# EAGLE design linkit_smart_extendboard (EAGLE 7.6.0)
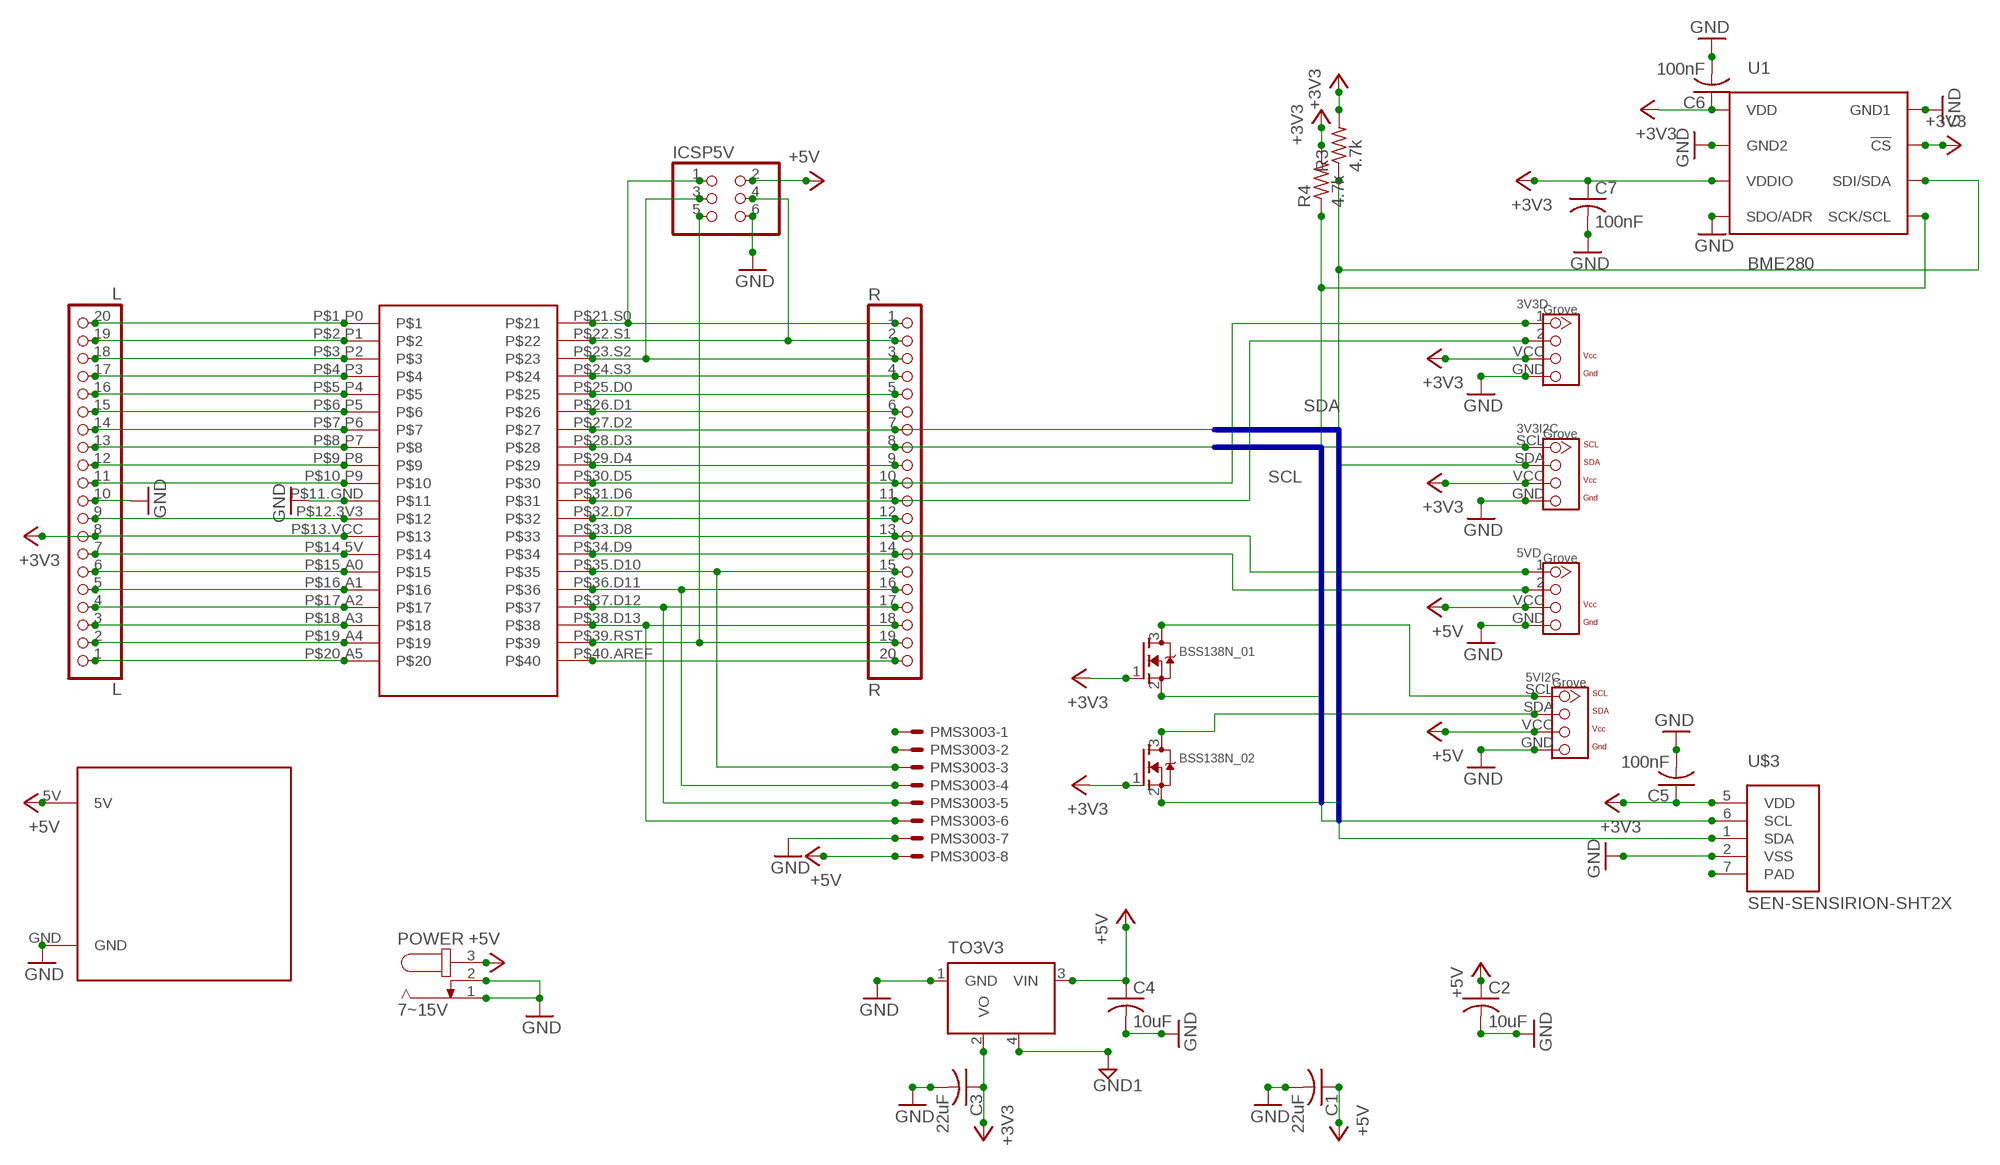
[diagram p0: schematic, sheet 1]

## Parts
3V3D  TWIG-4P-2.0-2.0  [4P-2.0]
3V3I2C  TWIG-4P-2.0-2.0  [4P-2.0]
5VD  TWIG-4P-2.0-2.0  [4P-2.0]
5VI2C  TWIG-4P-2.0-2.0  [4P-2.0]
BSS138N_01  MOSFET-NWAVE  [SOT23-W]
BSS138N_02  MOSFET-NWAVE  [SOT23-W]
C1  22uF  C-USC0805K  [C0805K]
C2  10uF  C-USC0805K  [C0805K]
C3  22uF  C-USC0805K  [C0805K]
C4  10uF  C-USC0805K  [C0805K]
C5  100nF  C-USC0805K  [C0805K]
C6  100nF  C-USC0805K  [C0805K]
C7  100nF  C-USC0805K  [C0805K]
ICSP5V  PINHD-2X3  [2X03]
L  L  PINHD-1X20-BIG  [1X20-BIG]
PMS3003  53047-08  [53047-08]
POWER  7~15V  JACK-PLUG0  [SPC4077]
R  R  PINHD-1X20-BIG  [1X20-BIG]
R3  4.7k  R-US_R0805  [R0805]
R4  4.7k  R-US_R0805  [R0805]
TO3V3  LM2936MP-3.0  [SOT223]
U1  BME280  [BME280_LGA]
U$1  LINKIT7688  [LINKIT7688]
U$3  SEN-SENSIRION-SHT2X  [SEN-SENSIRION-SHT2X]
U$4  PIN2MM  [PIN2MM]

## Nets
+3V3: 3V3D.VCC 3V3I2C.VCC BSS138N_01.1(G) BSS138N_02.1(G) C3.1 C5.1 C6.1 C7.1 L.8 R3.2 R4.2 TO3V3.2(VO) U1.P$2(!CS) U1.P$6(VDDIO) U1.P$8(VDD) U$1.P$13.VCC U$3.5(VDD)
+5V: 5VD.VCC 5VI2C.VCC C1.1 C2.1 C4.1 ICSP5V.2 PMS3003.8 POWER.3 TO3V3.3(VIN) U$4.5V
GND: 3V3D.GND 3V3I2C.GND 5VD.GND 5VI2C.GND C1.2 C2.2 C3.2 C4.2 C5.2 C6.2 C7.2 ICSP5V.6 L.10 PMS3003.7 POWER.1 POWER.2 TO3V3.1(GND) U1.P$1(GND1) U1.P$5(SDO/ADR) U1.P$7(GND2) U$1.P$11.GND U$3.2(VSS) U$4.GND
GND1: TO3V3.4(HS)
N$1: L.9 U$1.P$12.3V3
N$2: PMS3003.3 R.15 U$1.P$35.D10
N$3: L.7 U$1.P$14.5V
N$4: L.6 U$1.P$15.A0
N$5: L.5 U$1.P$16.A1
N$6: L.4 U$1.P$17.A2
N$7: L.3 U$1.P$18.A3
N$8: L.2 U$1.P$19.A4
N$9: L.1 U$1.P$20.A5
N$10: 3V3D.1 R.10 U$1.P$30.D5
N$11: L.19 U$1.P$2.P1
N$12: L.18 U$1.P$3.P2
N$13: L.17 U$1.P$4.P3
N$14: L.16 U$1.P$5.P4
N$15: L.15 U$1.P$6.P5
N$16: L.14 U$1.P$7.P6
N$17: L.13 U$1.P$8.P7
N$18: L.12 U$1.P$9.P8
N$19: L.11 U$1.P$10.P9
N$20: L.20 U$1.P$1.P0
N$21: ICSP5V.1 R.1 U$1.P$21.S0
N$22: ICSP5V.4 R.2 U$1.P$22.S1
N$23: ICSP5V.3 R.3 U$1.P$23.S2
N$24: R.4 U$1.P$24.S3
N$25: R.5 U$1.P$25.D0
N$26: R.6 U$1.P$26.D1
N$27: R.9 U$1.P$29.D4
N$28: R.12 U$1.P$32.D7
N$29: PMS3003.4 R.16 U$1.P$36.D11
N$30: 5VD.2 R.14 U$1.P$34.D9
N$31: 3V3D.2 R.11 U$1.P$31.D6
N$32: U$3.7(PAD)
N$33: 5VD.1 R.13 U$1.P$33.D8
N$34: ICSP5V.5 R.19 U$1.P$39.RST
N$35: PMS3003.6 R.18 U$1.P$38.D13
N$36: 5VI2C.SCL BSS138N_01.3(D)
N$37: R.20 U$1.P$40.AREF
N$38: PMS3003.5 R.17 U$1.P$37.D12
N$39: 5VI2C.SDA BSS138N_02.3(D)
N$40: PMS3003.1
N$41: PMS3003.2
SCL: 3V3I2C.SCL BSS138N_01.2(S) R4.1 R.8 U1.P$4(SCK/SCL) U$1.P$28.D3 U$3.6(SCL)
SDA: 3V3I2C.SDA BSS138N_02.2(S) R3.1 R.7 U1.P$3(SDI/SDA) U$1.P$27.D2 U$3.1(SDA)

## Buses
SDA
SCL

## Library data of the parts
3V3D 5VD = Connector_grove:TWIG-4P-2.0
3V3I2C 5VI2C = Connector_grove_i2c:TWIG-4P-2.0
BSS138N_01 BSS138N_02 = adafruit:MOSFET-N: N-Channel Mosfet 2N7002E - 60V 260mA SOT23 [Digikey: 2N7002ET1GOSTR-ND] - REEL BSH103 - 30V 850mA SOT23 [Digikey: 568-5013-1-ND]
C1-C7 = rcl:C-US: CAPACITOR, American symbol
ICSP5V = pinhead:PINHD-2X3: PIN HEADER
L R = adafruit:PINHD-1X20: PIN HEADER
PMS3003 = con-molex:53?-08: CONNECTOR wire to board 1.25 mm (.049 inch) pitch header; MPN: 53047-0810; OC_FARNELL: 1012258; OC_NEWARK: 98K9826
POWER = con-jack:JACK-PLUG: DC POWER JACK Power Jack, DC, Right Angle, Through Hole, Rated 5A at 16VDC, PC Terminals Distributor: Farnell (www.Farnell.de) Drawing: 84N1161.pdf / 84N1162.pdf Manufacturer: SPC Technology (www.spctechnology.com) Type: SPC4077 / SPC 4078; OC_FARNELL: unknown; OC_NEWARK: unknown
R3 R4 = resistor:R-US_: RESISTOR, American symbol
TO3V3 = national-semiconductor:LM2936MP?*: Ultra-Low Quiescent Current LDO Voltage Regulator Source: Data sheet <http://www.national.com/ds/LM/LM2936.pdf>; MF: NATIONAL SEMICONDUCTOR; MPN: LM2936MP-3.0/NOPB; OC_FARNELL: 1496125; OC_NEWARK: 41K4522
U1 = BME280ComponentLibrary:BME280; PROD_ID: IC-13090
U$1 = linkit7688:LINKIT7688: Linkit Smart 7688
U$3 = sht2x:SEN-SENSIRION-SHT2X
U$4 = pin_2mm:PIN2MM: 2mm pin head

## Module PIN
Ports: 

### Library data of the parts

## Board
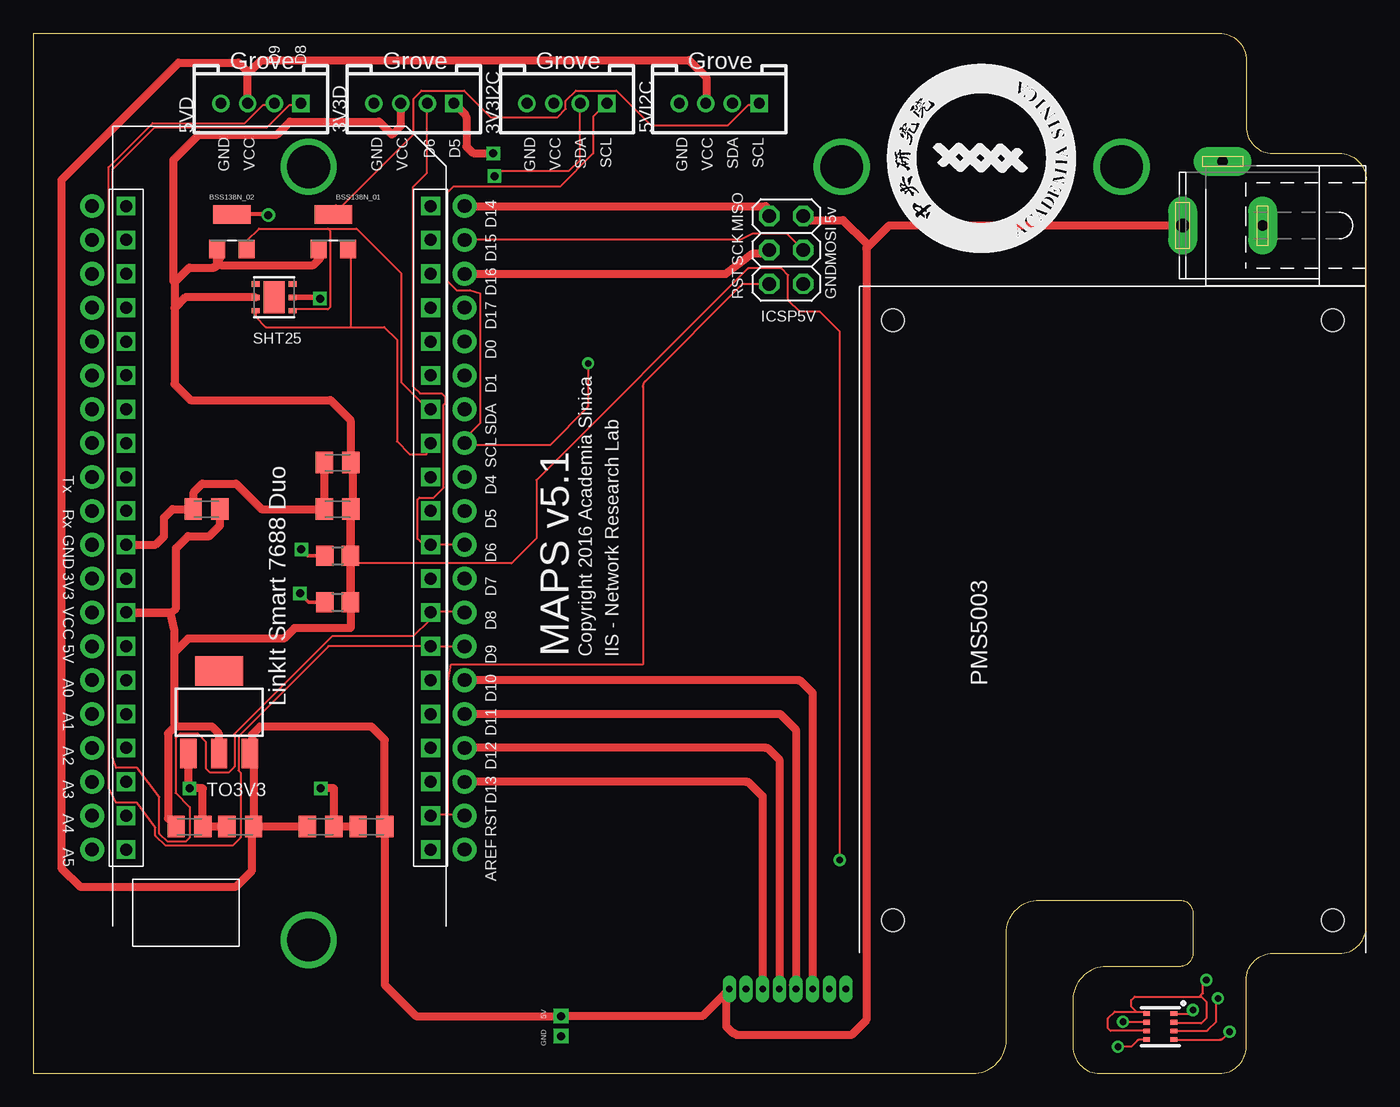
[diagram p1: board, top side]
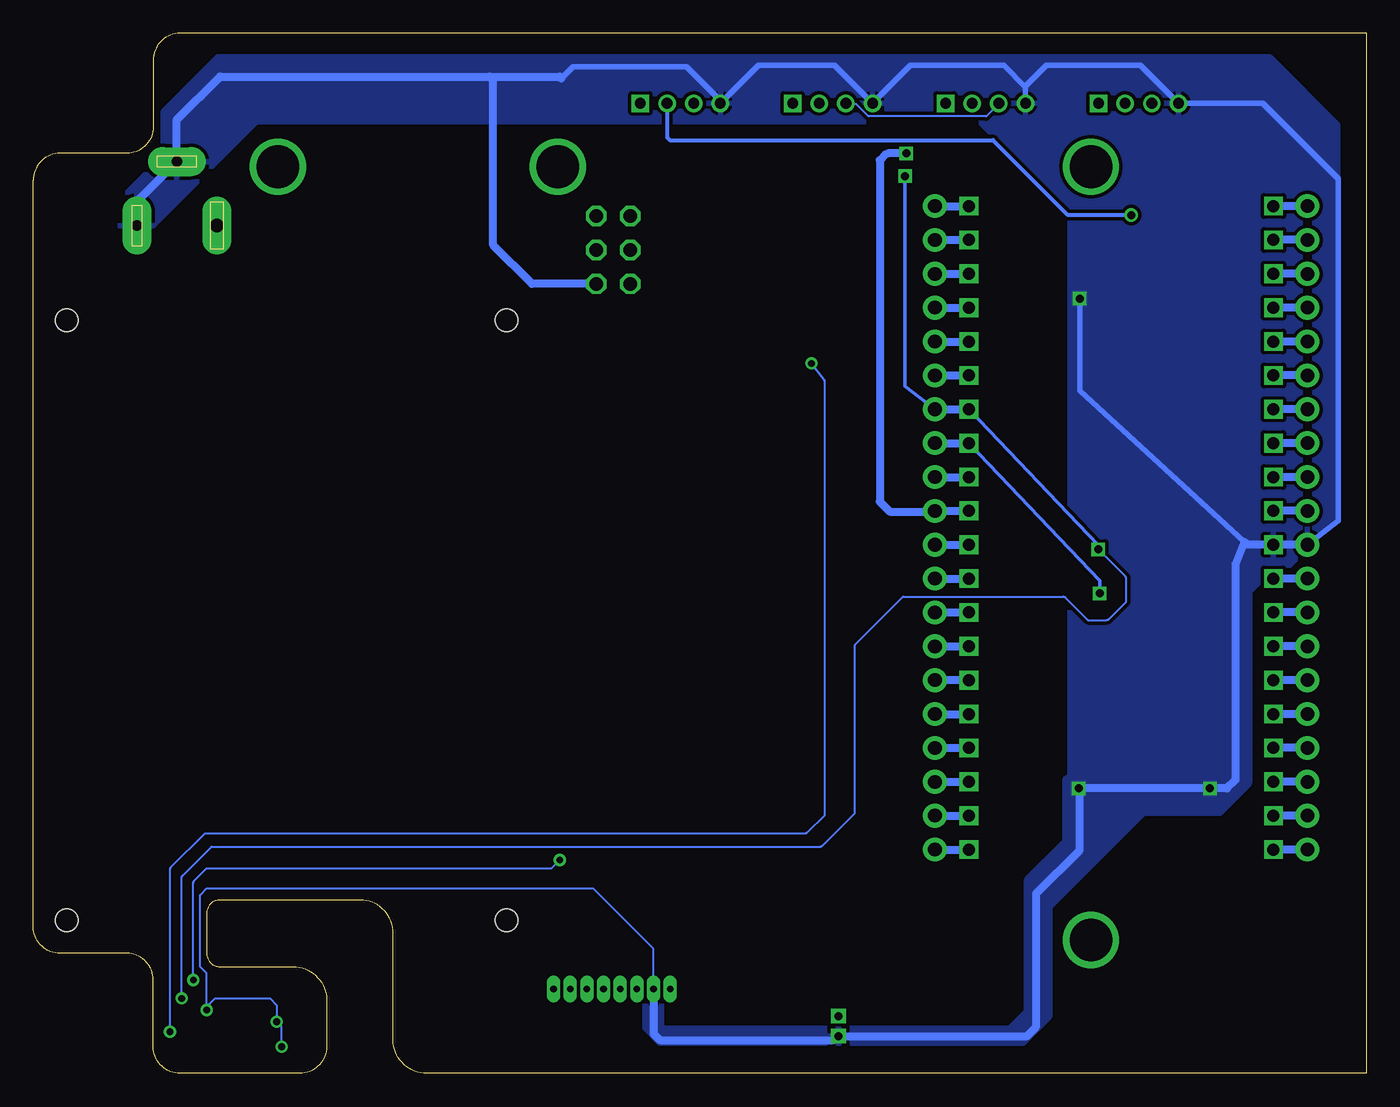
[diagram p2: board, bottom side, seen from below]

Size 100 x 78 mm. Coordinates in mm from the lower left corner, seen from the top.
Outline: 100,11 100,67 arc90 98,69 93,69 arc-90 91,71 91,76 arc90 89,78 0,78 0,0 70.5,0 arc90 73,2.5 73,10.5 arc-90 75.5,13 86,13 arc-90 87,12 87,9 arc-90 86,8 80.5,8 arc90 78,5.5 78,2 arc90 80,0 89,0 arc90 91,2 91,7 arc-90 93,9 98,9 arc90 100,11
Copper layers (1*16): Top 0.035mm / dielectric 1.5mm / Bottom 0.035mm
Design rules "jetpcb *": minimum track width 5mil, minimum drill 0.2499375mm, track to track 5mil, track to pad 5mil, pad to pad 5mil, via to via 5mil, smd to smd 5mil, copper to edge 0mil, drill to drill 0.2499375mm, minimum pad ring 10mil, minimum via ring 8mil, stop-mask expansion 4mil, vias tented up to drill 0mil, thermal gap 10mil
Holes 1.7 mm at 97.5,56.5 64.5,56.5 97.5,11.5 64.5,11.5

### Footprints (pad centres in the part's own frame; a part is rotated, then mirrored left to right if it is on the bottom)
4P-2.0 = drill 0.8 pad 1.27 square: 1 -3,0 | drill 0.8 pad 1.27: 2 -1,0; GND 3,0; VCC 1,0
4P-2.0' = drill 0.8 pad 1.27: GND 3,0; SDA -1,0; VCC 1,0 | drill 0.8 pad 1.27 square: SCL -3,0
SOT23-W = smd 1.2 x 1.4: 1 -1.1,-1.3; 2 1.1,-1.3 | smd 2.8 x 1.4: 3 0,1.3
C0805K = smd 1.3 x 1.6: 1 -1,0; 2 1,0
2X03 = drill 1.016 octagon: 1 -2.54,-1.27; 2 -2.54,1.27; 3 0,-1.27; 4 0,1.27; 5 2.54,-1.27; 6 2.54,1.27
1X20-BIG = drill 1.016 pad 1.778: 1 -24.13,0; 2 -21.59,0; 3 -19.05,0; 4 -16.51,0; 5 -13.97,0; 6 -11.43,0; 7 -8.89,0; 8 -6.35,0; 9 -3.81,0; 10 -1.27,0; 11 1.27,0; 12 3.81,0; 13 6.35,0; 14 8.89,0; 15 11.43,0; 16 13.97,0; 17 16.51,0; 18 19.05,0; 19 21.59,0; 20 24.13,0
53047-08 = drill 0.5 pad 0.698 long: 1 4.375,0.45; 2 3.125,0.45; 3 1.875,0.45; 4 0.625,0.45; 5 -0.625,0.45; 6 -1.875,0.45; 7 -3.125,0.45; 8 -4.375,0.45
SPC4077 = drill 0.8 pad 2.184 long: 1 -3,0; 2 0,-4.8 | drill 1 pad 2.184 long: 3 3,0
R0805 = smd 1.3 x 1.5: 1 -0.95,0; 2 0.95,0
SOT223 = smd 1.219 x 2.235: 1 -2.311,-3.099; 2 0,-3.099; 3 2.311,-3.099 | smd 3.6 x 2.2: 4 0,3.099
BME280_LGA = smd 0.5 x 0.35: P$1 1.025,0.975; P$2 1.025,0.325; P$3 1.025,-0.325; P$4 1.025,-0.975; P$5 -1.025,-0.975; P$6 -1.025,-0.325; P$7 -1.025,0.325; P$8 -1.025,0.975
LINKIT7688 = drill 0.9 square: P$1.P0 0,0; P$2.P1 0,-2.54; P$3.P2 0,-5.08; P$4.P3 0,-7.62; P$5.P4 0,-10.16; P$6.P5 0,-12.7; P$7.P6 0,-15.24; P$8.P7 0,-17.78; P$9.P8 0,-20.32; P$10.P9 0,-22.86; P$11.GND 0,-25.4; P$12.3V3 0,-27.94; P$13.VCC 0,-30.48; P$14.5V 0,-33.02; P$15.A0 0,-35.56; P$16.A1 0,-38.1; P$17.A2 0,-40.64; P$18.A3 0,-43.18; P$19.A4 0,-45.72; P$20.A5 0,-48.26; P$21.S0 22.86,0; P$22.S1 22.86,-2.54; P$23.S2 22.86,-5.08; P$24.S3 22.86,-7.62; P$25.D0 22.86,-10.16; P$26.D1 22.86,-12.7; P$27.D2 22.86,-15.24; P$28.D3 22.86,-17.78; P$29.D4 22.86,-20.32; P$30.D5 22.86,-22.86; P$31.D6 22.86,-25.4; P$32.D7 22.86,-27.94; P$33.D8 22.86,-30.48; P$34.D9 22.86,-33.02; P$35.D10 22.86,-35.56; P$36.D11 22.86,-38.1; P$37.D12 22.86,-40.64; P$38.D13 22.86,-43.18; P$39.RST 22.86,-45.72; P$40.AREF 22.86,-48.26
SEN-SENSIRION-SHT2X = smd 0.4 x 0.6: 1 -1,-1.4; 2 0,-1.4; 3 1,-1.4; 4 1,1.4; 5 0,1.4; 6 -1,1.4 | smd 2.4 x 1.6: 7 0,0
PIN2MM = drill 0.6 square: 5V 0.5,0.5; GND 2,0.5

### Placement (x,y rotation side)
3V3D  28.56,72.75 180 top
3V3I2C  [4P-2.0']  40.04,72.75 180 top
5VD  17.08,72.75 180 top
5VI2C  [4P-2.0']  51.45,72.75 180 top
BSS138N_01  22.51,63.12 0 top
BSS138N_02  14.89,63.12 0 top
C1  21.56,18.51 0 top
C2  25.37,18.51 180 top
C3  11.72,18.51 0 top
C4  15.53,18.51 180 top
C5  12.99,42.32 180 top
C6  22.83,45.81 180 top
C7  22.83,42.32 180 top
ICSP5V  56.48,61.75 270 top
L  4.42,40.91 90 top
PMS3003  56.59,5.87 0 top
POWER  89.23,63.58 180 top
R  32.35,40.91 270 top
R3  22.83,38.83 0 top
R4  22.83,35.34 0 top
TO3V3  13.94,27.08 0 top
U1  84.54,3.5 0 top
U$1  6.96,65.05 0 top
U$2  [G5]  99.98,9.03 180 top
U$3  18.07,58.2 90 top
U$4  39.1,4.8 270 top

### Tracks (layer width: path | path; a pad name or v marks a point on that pad's centre or on a via)
+3V3  (via drill 0.5)
  Top 0.152: 23.94,42.32 C7.1 | 23.94,45.81 C6.1 | 13.94,24.22 TO3V3.2 | 14,61.12 14,61.25 BSS138N_02.1 | U1.P$6 80.82,3.18 80.62,3.38 80.62,4.12 81.12,4.62 82.75,4.62 | 82.75,4.62 83.37,4.62 | 83.37,4.62 U1.P$8 83.38,4.62 83.37,4.62 | 87.5,5.75 87.62,5.75 88,5.38 88,4.12 87.62,3.75 85.64,3.75 U1.P$2 | 82.75,4.62 82.38,5 82.38,5.5 82.62,5.75 87.5,5.75 | 87.5,5.75 87.75,6 87.75,6.64 arc-45 87.82,6.82 v88,7 | v60.5,16 60.5,55.62 59,57.12 57.5,57.12 56.62,58 56.62,59.88 56.12,60.38 53.62,60.38 37.75,44.5 37.75,40.12 35.88,38.25 24.36,38.25 R3.2
  Top 0.61: 23.94,45.81 23.94,42.32 23.78,42.16 R3.2 R4.2 | 13.94,24.22 13.94,25.46 13.4,26 10.6,26 | 10.6,26 10.1,25.5 10.1,19.12 C3.1 | 10.6,26 10.6,31.6 | 10.6,31.6 10.6,33.2 10.3,34.5 7.52,34.5 U$1.P$13.VCC 10.37,34.56 10.7,34.9 10.7,39.4 11.6,40.3 13.2,40.3 14,41.1 14,42.31 C5.1 | C7.1 23.8,42.29 23.8,33.4 19.6,33.4 18.8,32.6 11.6,32.6 10.6,31.6 | 3V3D.VCC 27.56,71.06 26.9,70.4 25.93,71.38 19.25,71.38 18.27,70.4 12.4,70.4 10.5,68.5 10.5,59.42 10.6,59.33 | 10.6,59.33 10.6,57.4 | 10.6,57.4 10.6,51.7 11.8,50.5 22.3,50.5 23.8,49 23.8,45.84 C6.1 | 10.6,59.33 11.7,60.42 13.47,60.42 arc90 13.79,60.74 BSS138N_02.1 13.79,60.94 arc90 14.11,60.62 21,60.62 21.5,61.12 21.5,61.73 BSS138N_01.1 | U$3.5 11.39,58.2 10.6,57.4 | 13.8,61.12 14,61.12
  Bottom 0.152: 3V3I2C.VCC 39.01,72.69 38.25,72.69 37.34,71.78 28.5,71.78 27.58,72.69 3V3D.VCC | v60.5,16 61.12,15.38 68.38,15.38 68.88,15.38 87,15.38 87.93,14.45 arc-45 88,14.27 v88,7
  Bottom 0.61: L.8 U$1.P$13.VCC
+5V
  Top 0.61: C4.1 16.53,23.98 TO3V3.3 16.4,24.13 16.4,25.4 17,26 25.38,26 26.37,25 C2.1 26.38,6.62 28.7,4.3 U$4.5V 50.2,4.3 PMS3003.8 52.09,6.19 arc45 52,5.97 52,3.5 52.41,3.09 arc45 52.63,3 52.76,2.88 61.38,2.88 62.5,4 62.5,61.88 | C1.1 C4.1 | 5VI2C.VCC 50.5,72.8 50.5,74.7 49.2,76 17.1,76 16.08,74.98 5VD.VCC 16.08,75.12 15.4,75.8 10.9,75.8 2.1,67 2.1,15.4 3.5,14 15.2,14 16.4,15.2 16.4,18.38 C4.1 | ICSP5V.2 58.05,64 60.75,64 62.5,62.25 62.5,61.88 | POWER.3 64.2,63.58 62.5,61.88
GND  (via drill 0.5, 0.6)
  Top 0.152: v81.75,3.88 83.47,3.88 U1.P$7 | U1.P$1 86.73,4.48 v87,4.75 | U1.P$5 83.01,2.53 arc45 82.83,2.45 82.38,2 v81.38,2
  Top 0.406: U$3.2 21.41,58.2 v21.5,58.1
  Top 0.61: C2.2 C1.2 22.56,21.36 v21.56,21.36 | C4.2 C3.2 12.72,21.36 v11.72,21.36 11.63,21.36 TO3V3.1 | C6.2 C7.2 17.11,42.32 15.21,44.23 12.67,44.23 12.04,43.59 12.04,42.32 C5.2 10.45,42.32 9.81,41.69 9.81,40.28 9.18,39.65 U$1.P$11.GND
  Bottom 0.152: v81.38,2 81.38,3.5 v81.75,3.88 81.75,5.12 82.25,5.62 86.38,5.62 87,5 v87,4.75 87,7.5 87.5,8 87.5,13.38 87,13.88 58,13.88 53.5,9.38 53.5,6.35 PMS3003.7
  Bottom 0.406: L.10 2.1,41.46 2.1,67.1 7.75,72.75 5VD.GND 16.93,75.6 24,75.6 25.56,74.04 3V3D.GND 25.56,73.96 27.2,75.6 34.19,75.6 3V3I2C.GND 39.88,75.6 45.6,75.6 5VI2C.GND 48.45,72.95 51,75.5 59.5,75.5 60.38,74.62 | v21.5,58.1 21.5,51.2 9.15,39.85
  Bottom 0.61: U$1.P$11.GND L.10 8.86,39.65 9.15,39.85 9.81,38.19 9.81,22 10.45,21.36 v11.72,21.36 v21.56,21.36 21.5,21.3 21.5,16.75 24.75,13.5 24.75,3.5 25.45,2.8 U$4.GND 39.81,2.59 arc45 40.03,2.5 53,2.5 53.37,2.87 arc45 53.47,3.1 PMS3003.7 | POWER.1 92.23,65.38 POWER.2 89.23,71.52 86,74.75 65.75,74.75 | 65.75,74.75 60.5,74.75 60.38,74.62 | ICSP5V.6 62.59,59.21 65.5,62.12 65.5,74.5 65.75,74.75
  pour Bottom (isolate 0.254): 93.38,65.5 arc45 93.29,65.71 90.25,68.75 90.25,71.99 arc45 90.16,72.22 86.12,76.25 7.38,76.25 arc45 7.16,76.16 2.12,71.12 2.12,41.88 arc45 2.22,41.66 5.88,38 6.74,38 arc-45 6.97,37.91 8.75,36.12 8.75,21.88 arc45 8.84,21.66 11,19.5 16.62,19.5 arc-45 16.84,19.41 23.75,12.5 23.75,4.38 arc45 23.84,4.16 25.75,2.25 52.87,2.25 arc45 53.09,2.34 54.12,3.38 54.12,6.62 arc45 54.03,6.84 53.75,7.12 53.47,6.84 arc-45 53.24,6.75 53.12,6.75 52.97,6.59 arc45 52.88,6.37 52.88,3.38 26.88,3.38 arc-45 26.66,3.47 25.5,4.62 25.5,14.37 arc45 25.41,14.59 22.62,17.38 22.62,21.87 arc45 22.53,22.09 22.25,22.38 22.25,64.49 arc-45 22.34,64.72 25.62,68 28.91,71.28 arc-45 29.13,71.38 79.62,71.38 83.12,71.38 arc-45 83.34,71.28 91.38,63.25 93.12,63.25 arc45 93.34,63.34 93.5,63.5 93.5,65.5
N$1
  Bottom 0.61: L.9 U$1.P$12.3V3
N$2
  Top 0.61: 58.5,6.39 arc-45 PMS3003.3 58.47,28.53 57.61,29.39 arc45 57.38,29.48 R.15
  Bottom 0.61: U$1.P$35.D10 R.15
N$3
  Bottom 0.61: L.7 U$1.P$14.5V
N$4
  Bottom 0.61: L.6 U$1.P$15.A0
N$5
  Bottom 0.61: L.5 U$1.P$16.A1
N$6
  Bottom 0.61: L.4 U$1.P$17.A2
N$7
  Bottom 0.61: L.3 U$1.P$18.A3
N$8
  Bottom 0.61: L.2 U$1.P$19.A4
N$9
  Bottom 0.61: L.1 U$1.P$20.A5
N$10  (via drill 0.6)
  Top 0.152: 32.43,71.89 arc-45 32.5,71.71 | 32.93,69.07 arc45 33.1,69
  Top 0.61: 3V3D.1 32.43,71.89 | 32.5,71.71 32.5,69.5 32.93,69.07 | 33.1,69 v34.5,69
  Bottom 0.152: 35.9,69 arc-45 36.07,68.93
  Bottom 0.61: U$1.P$30.D5 R.10 32.41,42.12 35.75,42.12 36.5,42.88 36.5,68.5 36.07,68.93 | v34.5,69 35.9,69
N$11
  Bottom 0.61: L.19 U$1.P$2.P1
N$12
  Bottom 0.61: L.18 U$1.P$3.P2
N$13
  Bottom 0.61: L.17 U$1.P$4.P3
N$14
  Bottom 0.61: L.16 U$1.P$5.P4
N$15
  Bottom 0.61: L.15 U$1.P$6.P5
N$16
  Bottom 0.61: L.14 U$1.P$7.P6
N$17
  Bottom 0.61: L.13 U$1.P$8.P7
N$18
  Bottom 0.61: L.12 U$1.P$9.P8
N$19
  Bottom 0.61: L.11 U$1.P$10.P9
N$20
  Bottom 0.61: L.20 U$1.P$1.P0
N$21
  Top 0.61: R.1 54.96,65.05 ICSP5V.1
  Bottom 0.61: R.1 U$1.P$21.S0
N$22
  Top 0.152: R.2 53.01,62.51 54,63 56.51,63 ICSP5V.4
  Top 0.61: 32.37,62 arc-45 R.2
  Bottom 0.61: R.2 U$1.P$22.S1
N$23
  Top 0.61: R.3 51.97,59.97 54,61.5 54.96,61.5 ICSP5V.3
  Bottom 0.61: R.3 U$1.P$23.S2
N$24
  Bottom 0.61: R.4 U$1.P$24.S3
N$25
  Bottom 0.61: R.5 U$1.P$25.D0
N$26
  Bottom 0.61: R.6 U$1.P$26.D1
N$27
  Bottom 0.61: R.9 U$1.P$29.D4
N$28
  Bottom 0.61: R.12 U$1.P$32.D7
N$29
  Top 0.61: 57,6.66 arc45 57.09,6.44 PMS3003.4 57.22,25.78 56.15,26.85 arc45 55.92,26.95 R.16
  Bottom 0.61: R.16 U$1.P$36.D11
N$30
  Top 0.152: 5VD.2 18,72.63 17.24,72.63 15.87,71.26 8.94,71.26 5.65,67.97 5.65,21.38 6.22,20.31 7.78,20.31 9.15,18.44 9.15,17.83 9.92,17.07 14.95,17.07 15.55,17.68 15.55,22.55 15.4,22.71 15.4,25.3 22.15,32.05 29.73,32.05 U$1.P$34.D9 29.88,32.05 32.32,32.05 R.14
  Bottom 0.61: R.14 U$1.P$34.D9
N$31
  Top 0.152: 3V3D.2 29.43,72.63 29.5,72.56 29.5,67.5 28.51,66.51 28.51,51.49 29,51 30.62,51 30.88,50.75 30.88,50.22 30.8,50.14 30.8,43.93 30.03,43.17 28.97,43.17 28.81,43.02 28.81,40.08 29.23,39.67 U$1.P$31.D6 29.88,39.67 32.32,39.67 R.11
  Bottom 0.61: R.11 U$1.P$31.D6
N$33
  Top 0.152: 5VD.1 19.98,72.63 19.22,72.63 17.54,70.96 9.09,70.96 5.95,67.82 5.95,23.66 6.22,22.9 7.78,22.9 9.46,20.73 9.46,17.98 10.07,17.37 11.44,17.37 11.74,17.68 11.74,19.96 10.68,21.03 10.68,25.15 10.98,25.45 12.36,25.45 12.96,24.84 12.96,22.86 13.27,22.55 14.64,22.55 15.1,23.01 15.1,25.45 22.41,32.77 28.51,32.77 29.73,33.98 U$1.P$33.D8 29.88,34.64 32.32,34.64 R.13
  Bottom 0.61: R.13 U$1.P$33.D8
N$34
  Top 0.152: 31.1,19.4 32.32,19.4 R.19 | 31.1,19.4 29.88,19.4 U$1.P$39.RST | 31.1,19.4 31.1,29.41 31.36,30.68 45.73,30.68 45.73,51.47 arc-45 45.92,51.92 53.21,59.21 ICSP5V.5
  Bottom 0.61: R.19 U$1.P$39.RST
N$35
  Top 0.61: 54.5,6.66 arc45 54.59,6.44 PMS3003.6 54.72,20.78 53.73,21.77 arc45 53.5,21.86 R.18
  Bottom 0.61: R.18 U$1.P$38.D13
N$36
  Top 0.152: 5VI2C.SCL 54.42,72.63 53.66,72.63 52.14,71.11 46.34,71.11 43.75,73.7 40.71,73.7 39.94,72.94 39.94,72.33 39.34,71.72 34.31,71.72 32.32,73.7 29.12,73.7 28.51,73.09 28.51,70.42 BSS138N_01.3 | 22.57,65.03 BSS138N_01.3 | 22.71,65.12 BSS138N_01.3
N$37
  Bottom 0.61: R.20 U$1.P$40.AREF
N$38
  Top 0.61: 56,6.39 arc-45 PMS3003.5 55.97,23.53 55.19,24.31 arc45 54.96,24.41 R.17
  Bottom 0.61: R.17 U$1.P$37.D12
N$39  (via drill 0.6)
  Top 0.305: v17.62,64.38 17.58,64.42 BSS138N_02.3
  Bottom 0.305: 5VI2C.SDA 52.45,70.22 52.24,70 28,70 22.38,64.38 v17.62,64.38
S$6  (via drill 3.2 pad 0.25)
  other vias: 20.65,10
S$7  (via drill 3.2 pad 0.25)
  other vias: 20.65,68
S$8  (via drill 3.2 pad 0.25)
  other vias: 81.65,68
S$9  (via drill 3.2 pad 0.25)
  other vias: 60.65,68
SCL  (via drill 0.5, 0.6)
  Top 0.152: 22.04,35.34 R4.1 | 29.74,46.64 U$1.P$28.D3 29.5,46.45 28.23,46.45 27.27,47.4 27.27,55.02 26.32,55.97 23.8,55.97 | U$3.6 16.67,56.74 17.43,55.97 23.8,55.97 | BSS138N_01.2 23.63,62.28 23.8,62.28 23.8,55.97 | 3V3I2C.SCL 43,72.75 42,71.75 42,69 39.5,66.5 31.5,66.5 31,66 31,59.5 31.75,58.75 32.75,58.75 33.5,58.5 33.5,48.75 32.5,47.75 32.5,47 R.8 32.42,47.2 arc45 32.6,47.12 38.75,47.12 41.55,49.93 arc45 41.62,50.1 v41.62,53.25 | U1.P$4 89.05,2.53 arc45 89.23,2.6 v89.75,3.12
  Top 0.254: 22.04,35.34 20.66,35.34 v20,36
  Bottom 0.152: v89.75,3.12 89.75,15.27 arc45 89.68,15.45 87.12,18 42.1,18 arc-45 41.93,18.07 40.62,19.38 40.62,51.9 arc-45 40.7,52.07 v41.62,53.25
  Bottom 0.254: v20,36 20,36.95 U$1.P$28.D3
  Bottom 0.61: R.8 U$1.P$28.D3
SDA  (via drill 0.5, 0.6)
  Top 0.152: 22.11,63.35 22.26,63.2 22.26,57.45 22.11,57.3 19.52,57.3 U$3.1 | 22.11,63.35 16.93,63.35 16.01,62.44 BSS138N_02.2 | 22.11,63.35 24.24,63.35 27.59,60 27.59,51.82 29.73,49.68 29.73,49.88 U$1.P$27.D2 | 35,67.7 40.2,67.7 41,68.5 41,72.72 3V3I2C.SDA | U1.P$3 87.95,3.18 arc45 88.13,3.25 88.75,3.88 88.75,5.39 arc-45 88.82,5.57 v88.88,5.62
  Top 0.254: 35,67.7 v34.6,67.3 | R3.1 20.57,38.83 v20.1,39.3
  Bottom 0.152: v88.88,5.62 88.88,14.64 arc45 88.8,14.82 86.62,17 40.98,17 arc-45 40.8,17.07 38.38,19.5 38.38,32.02 arc45 38.3,32.2 34.75,35.75 22.73,35.75 arc45 22.55,35.68 20.88,34 19.48,34 arc-45 19.3,34.07 18,35.38 18,37.09 arc-45 18.07,37.27 v20.1,39.3
  Bottom 0.254: v34.6,67.3 34.6,51.55 R.7 | v20.1,39.3 20.1,39.59 U$1.P$27.D2
  Bottom 0.61: R.7 U$1.P$27.D2

### Text on the board
tPlace: /Users/jacklee/Downloads/AS logo-1_BW.bmp
tNames: D9 | D8 | D6 | D5 | D14 | 5v | D15 | MISO | SCK | MOSI | D16 | D17 | RST | GND | SHT25 | D0 | D1 | SDA | SCL | Tx | D4 | Rx | D5 | GND | D6 | 3V3 | D7 | VCC | D8 | 5V | D9 | MAPS v5.1 | Copyright 2016 Academia Sinica | IIS - Network Research Lab | A0 | D10 | A1 | D11 | A2 | D12 | A3 | D13 | RST | A4 | AREF | A5